# EAGLE schematic USB_Program_and_Charge_Dongle (EAGLE 6.6.0)
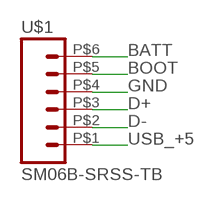
[diagram p0: schematic, sheet 1]

## Parts
U$1  SM06B-SRSS-TB  [SM06B-SRSS-TB]

## Nets
BATT: U$1.P$6
BOOT: U$1.P$5
D+: U$1.P$3
D-: U$1.P$2
GND: U$1.P$4
USB_+5: U$1.P$1

## Library data of the parts
U$1 = block_parts:SM06B-SRSS-TB